# EasyEDA Pro project split-keyboard.epro, board PCB13
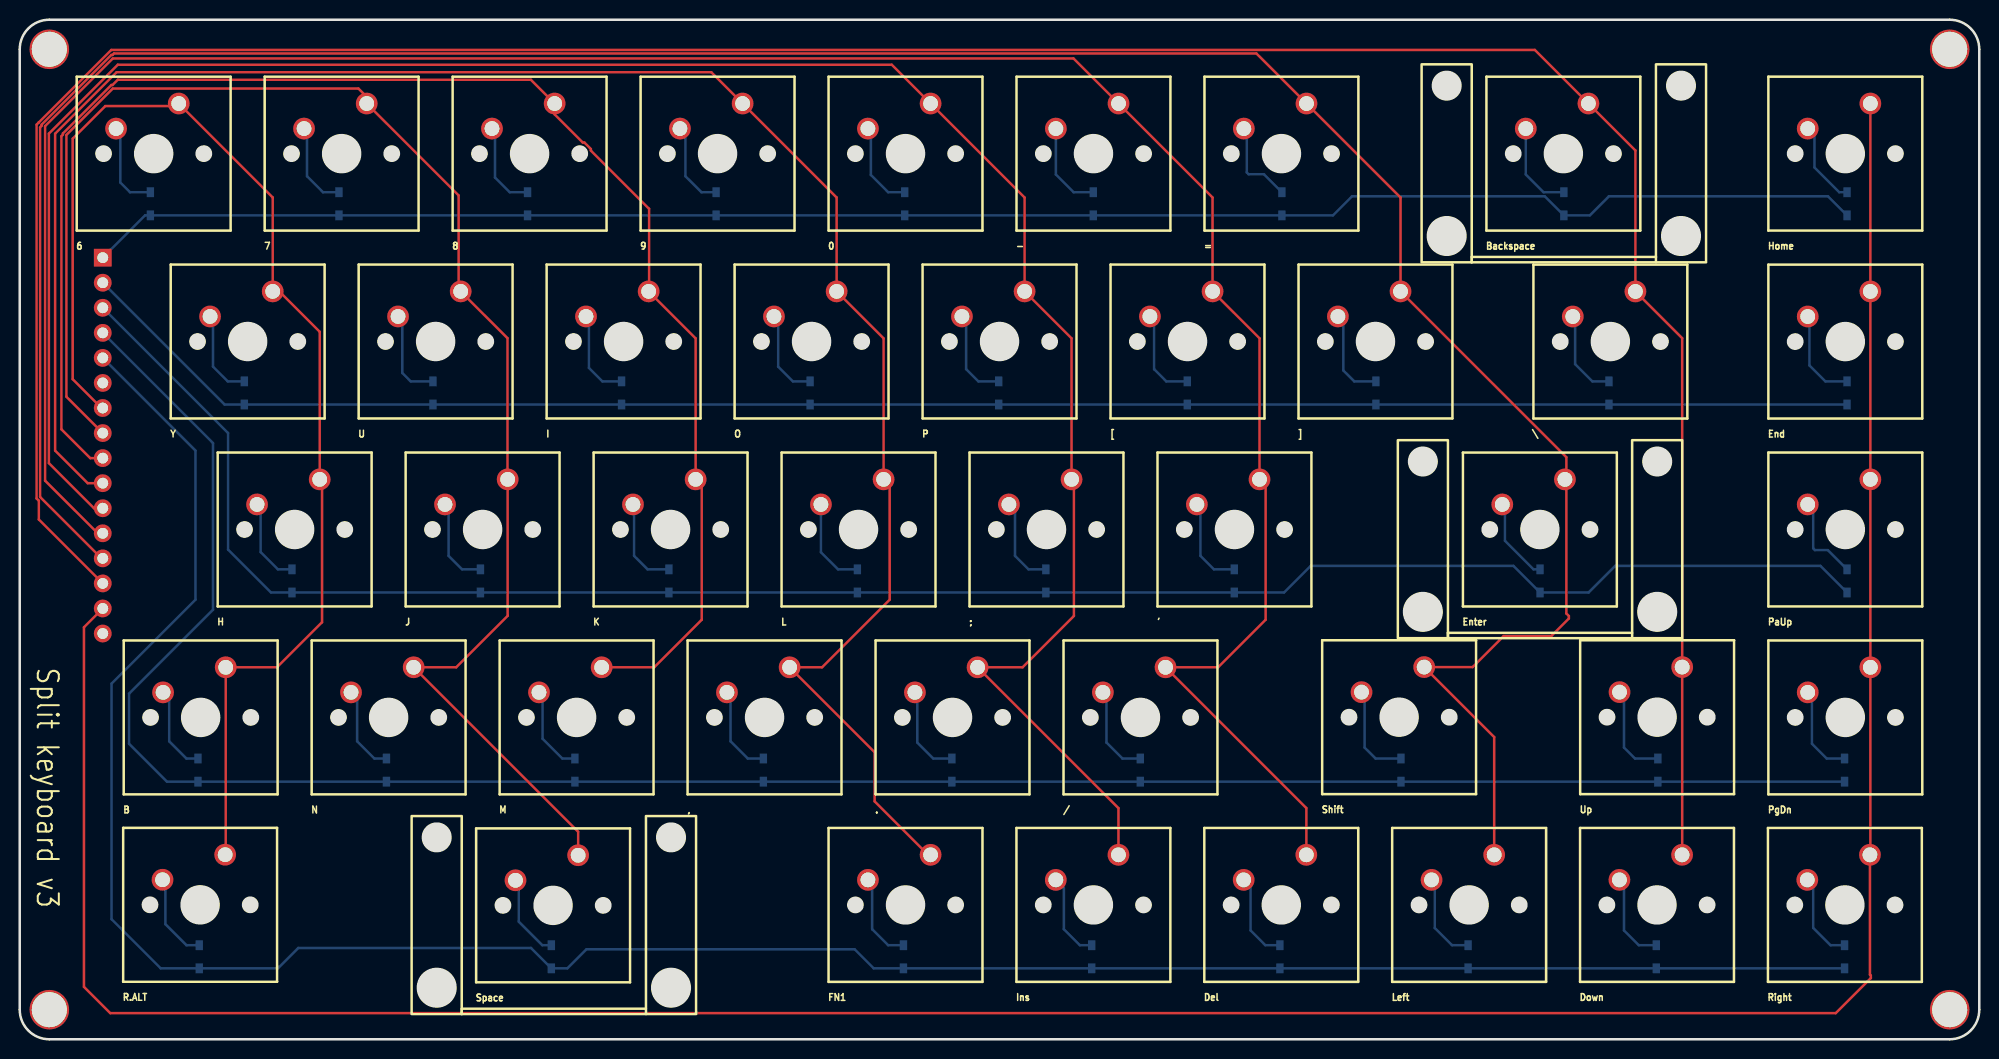
[diagram p7: board, top side]
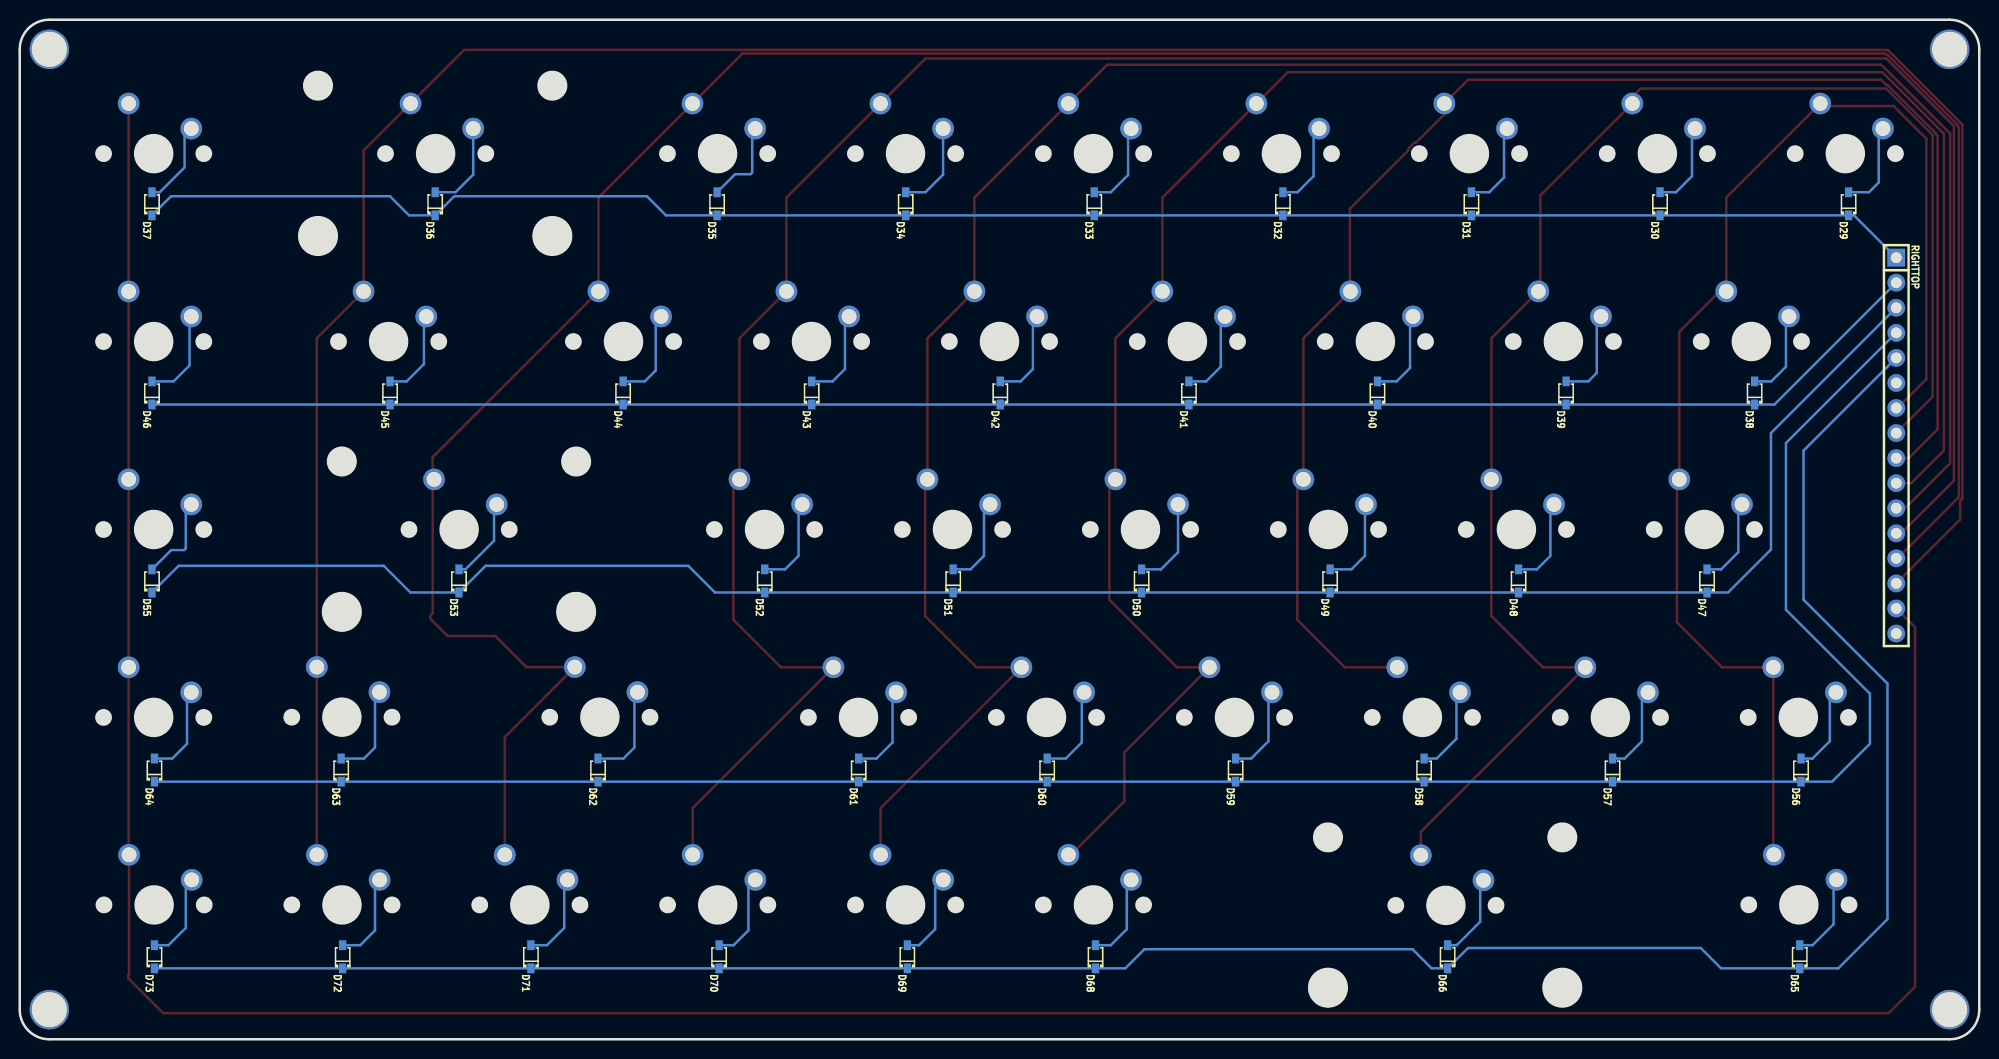
[diagram p8: board, bottom side, seen from below]

Outline 198.6 x 103.35 mm; copper layers: Top Layer, Bottom Layer. Coordinates in mm from the lower left corner of the outline.
Outline path: 0,100.35 0,3 arc(0.88,0.88) 3,0 195.6,0 arc(197.72,0.88) 198.6,3 198.6,100.35 arc(197.72,102.47) 195.6,103.35 3,103.35 arc(0.88,102.47) 0,100.35
Stack: Top Layer 0.035mm / Dielectric1 1.51mm FR4 er 4.5 / Bottom Layer 0.035mm

## Design rules (mm)
template: JLCPCB Capability(Two Layers Board)
spacing copperThickness1oz (default): track to track 0.102, other pairs 0.152 to 0.3
spacing copperThickness2oz: track to track 0.203, other pairs 0.152 to 0.3
track width copperThickness1oz (default): min 0.127, default 0.254, max 2.54
track width copperThickness2oz: min 0.203, default 0.254, max 2.54
differential pair differentialPair (default): width min 0.127, default 0.254, max 2.54; gap min 0.152, default 0.152
via viaSize (default): diameter min 0.5, default 0.61, max 10; hole min 0.3, default 0.305, max 6.3

## Placement (name value [footprint] x y rotation side)
0  MX1A-11NW  [cherry]  89.77 89.77 0 top
6  MX1A-11NW  [cherry]  13.57 89.77 0 top
7  MX1A-11NW  [cherry]  32.62 89.77 0 top
8  MX1A-11NW  [cherry]  51.67 89.77 0 top
9  MX1A-11NW  [cherry]  70.72 89.77 0 top
'  MX1A-11NW  [cherry]  123.11 51.67 0 top
,  MX1A-11NW  [cherry]  75.49 32.63 0 top
-  MX1A-11NW  [cherry]  108.82 89.77 0 top
.  MX1A-11NW  [cherry]  94.54 32.63 0 top
/  MX1A-11NW  [cherry]  113.59 32.63 0 top
;  MX1A-11NW  [cherry]  104.06 51.67 0 top
=  MX1A-11NW  [cherry]  127.87 89.77 0 top
[  MX1A-11NW  [cherry]  118.35 70.73 0 top
\  MX1A-11NW  [cherry]  161.21 70.72 0 top
]  MX1A-11NW  [cherry]  137.41 70.73 0 top
B  MX1A-11NW  [cherry]  18.34 32.63 0 top
Backspace  MX1A-11NW  [cherry]  156.45 89.77 0 top
BACKSPACE  -  [Cherry 2U Stabilizer Cutout]  54.07 13.61 0 top
D29  1N4148WS  [SOD-323_L1.8-W1.3-LS2.5-RD]  13.24 84.69 90 bottom
D30  1N4148WS  [SOD-323_L1.8-W1.3-LS2.5-RD]  32.35 84.69 90 bottom
D31  1N4148WS  [SOD-323_L1.8-W1.3-LS2.5-RD]  51.47 84.69 90 bottom
D32  1N4148WS  [SOD-323_L1.8-W1.3-LS2.5-RD]  70.58 84.69 90 bottom
D33  1N4148WS  [SOD-323_L1.8-W1.3-LS2.5-RD]  89.69 84.69 90 bottom
D34  1N4148WS  [SOD-323_L1.8-W1.3-LS2.5-RD]  108.81 84.69 90 bottom
D35  1N4148WS  [SOD-323_L1.8-W1.3-LS2.5-RD]  127.92 84.69 90 bottom
D36  1N4148WS  [SOD-323_L1.8-W1.3-LS2.5-RD]  156.5 84.69 90 bottom
D37  1N4148WS  [SOD-323_L1.8-W1.3-LS2.5-RD]  185.2 84.69 90 bottom
D38  1N4148WS  [SOD-323_L1.8-W1.3-LS2.5-RD]  22.77 65.51 90 bottom
D39  1N4148WS  [SOD-323_L1.8-W1.3-LS2.5-RD]  41.88 65.51 90 bottom
D40  1N4148WS  [SOD-323_L1.8-W1.3-LS2.5-RD]  60.99 65.51 90 bottom
D41  1N4148WS  [SOD-323_L1.8-W1.3-LS2.5-RD]  80.11 65.51 90 bottom
D42  1N4148WS  [SOD-323_L1.8-W1.3-LS2.5-RD]  99.22 65.51 90 bottom
D43  1N4148WS  [SOD-323_L1.8-W1.3-LS2.5-RD]  118.33 65.51 90 bottom
D44  1N4148WS  [SOD-323_L1.8-W1.3-LS2.5-RD]  137.45 65.51 90 bottom
D45  1N4148WS  [SOD-323_L1.8-W1.3-LS2.5-RD]  161.07 65.51 90 bottom
D46  1N4148WS  [SOD-323_L1.8-W1.3-LS2.5-RD]  185.2 65.51 90 bottom
D47  1N4148WS  [SOD-323_L1.8-W1.3-LS2.5-RD]  27.59 46.46 90 bottom
D48  1N4148WS  [SOD-323_L1.8-W1.3-LS2.5-RD]  46.69 46.46 90 bottom
D49  1N4148WS  [SOD-323_L1.8-W1.3-LS2.5-RD]  65.79 46.46 90 bottom
D50  1N4148WS  [SOD-323_L1.8-W1.3-LS2.5-RD]  84.89 46.46 90 bottom
D51  1N4148WS  [SOD-323_L1.8-W1.3-LS2.5-RD]  103.99 46.46 90 bottom
D52  1N4148WS  [SOD-323_L1.8-W1.3-LS2.5-RD]  123.09 46.46 90 bottom
D53  1N4148WS  [SOD-323_L1.8-W1.3-LS2.5-RD]  154.08 46.46 90 bottom
D55  1N4148WS  [SOD-323_L1.8-W1.3-LS2.5-RD]  185.2 46.46 90 bottom
D56  1N4148WS  [SOD-323_L1.8-W1.3-LS2.5-RD]  18.07 27.29 90 bottom
D57  1N4148WS  [SOD-323_L1.8-W1.3-LS2.5-RD]  37.17 27.29 90 bottom
D58  1N4148WS  [SOD-323_L1.8-W1.3-LS2.5-RD]  56.27 27.29 90 bottom
D59  1N4148WS  [SOD-323_L1.8-W1.3-LS2.5-RD]  75.37 27.29 90 bottom
D60  1N4148WS  [SOD-323_L1.8-W1.3-LS2.5-RD]  94.47 27.29 90 bottom
D61  1N4148WS  [SOD-323_L1.8-W1.3-LS2.5-RD]  113.57 27.29 90 bottom
D62  1N4148WS  [SOD-323_L1.8-W1.3-LS2.5-RD]  139.99 27.29 90 bottom
D63  1N4148WS  [SOD-323_L1.8-W1.3-LS2.5-RD]  166.02 27.29 90 bottom
D64  1N4148WS  [SOD-323_L1.8-W1.3-LS2.5-RD]  184.94 27.29 90 bottom
D65  1N4148WS  [SOD-323_L1.8-W1.3-LS2.5-RD]  18.19 8.36 90 bottom
D66  1N4148WS  [SOD-323_L1.8-W1.3-LS2.5-RD]  53.88 8.36 90 bottom
D68  1N4148WS  [SOD-323_L1.8-W1.3-LS2.5-RD]  89.57 8.36 90 bottom
D69  1N4148WS  [SOD-323_L1.8-W1.3-LS2.5-RD]  108.64 8.36 90 bottom
D70  1N4148WS  [SOD-323_L1.8-W1.3-LS2.5-RD]  127.72 8.36 90 bottom
D71  1N4148WS  [SOD-323_L1.8-W1.3-LS2.5-RD]  146.79 8.36 90 bottom
D72  1N4148WS  [SOD-323_L1.8-W1.3-LS2.5-RD]  165.87 8.36 90 bottom
D73  1N4148WS  [SOD-323_L1.8-W1.3-LS2.5-RD]  184.94 8.36 90 bottom
Del  MX1A-11NW  [cherry]  127.86 13.62 0 top
Down  MX1A-11NW  [cherry]  165.94 13.62 0 top
End  MX1A-11NW  [cherry]  185.02 70.72 0 top
Enter  MX1A-11NW  [cherry]  154.07 51.67 0 top
ENTER  -  [Cherry 2U Stabilizer Cutout]  154.02 51.71 0 top
FN1  MX1A-11NW  [cherry]  89.78 13.62 0 top
H  MX1A-11NW  [cherry]  27.86 51.67 0 top
Home  MX1A-11NW  [cherry]  185.02 89.77 0 top
I  MX1A-11NW  [cherry]  61.2 70.73 0 top
Ins  MX1A-11NW  [cherry]  108.82 13.62 0 top
J  MX1A-11NW  [cherry]  46.91 51.67 0 top
K  MX1A-11NW  [cherry]  65.96 51.67 0 top
L  MX1A-11NW  [cherry]  85.01 51.67 0 top
Left  MX1A-11NW  [cherry]  146.9 13.62 0 top
M  MX1A-11NW  [cherry]  56.44 32.63 0 top
N  MX1A-11NW  [cherry]  37.39 32.63 0 top
NOREF  -  [Pad_e411]  195.6 100.35 0 top
NOREF#2  -  [Pad_e412]  195.6 3 0 top
NOREF#3  -  [Pad_e413]  3 3 0 top
NOREF#4  -  [Pad_e407]  3 100.35 0 top
O  MX1A-11NW  [cherry]  80.25 70.73 0 top
P  MX1A-11NW  [cherry]  99.3 70.73 0 top
PaUp  MX1A-11NW  [cherry]  185.02 51.67 0 top
PgDn  MX1A-11NW  [cherry]  185.02 32.62 0 top
R.ALT  MX1A-11NW  [cherry]  18.28 13.63 0 top
Right  MX1A-11NW  [cherry]  184.98 13.62 0 top
RIGHTTOP  DS1021-1x16SF11-B  [HDR-TH_16P-P2.54-V-M]  8.41 60.18 270 bottom
Shift  MX1A-11NW  [cherry]  139.8 32.65 0 top
Space  MX1A-11NW  [cherry]  54.06 13.57 0 top
SPACEBAR  -  [Cherry 2U Stabilizer Cutout]  156.43 89.81 0 top
U  MX1A-11NW  [cherry]  42.15 70.73 0 top
Up  MX1A-11NW  [cherry]  165.95 32.65 0 top
Y  MX1A-11NW  [cherry]  23.1 70.73 0 top

## Footprints (pads in the part's own frame, mm; a bottom-side part is the same pattern mirrored in y, then rotated)
cherry
  round 2.2 hole 1.5: 1(-3.81,2.54) 2(2.54,5.08)
HDR-TH_16P-P2.54-V-M
  rect 1.8x1.8 hole 1.1: 1(-19.05,0)
  round 1.8 hole 1.1: 2(-16.51,0) 3(-13.97,0) 4(-11.43,0) 5(-8.89,0) 6(-6.35,0) 7(-3.81,0) 8(-1.27,0) 9(1.27,0) 10(3.81,0) 11(6.35,0) 12(8.89,0) 13(11.43,0) 14(13.97,0) 15(16.51,0) 16(19.05,0)
Pad_e407
  round 4 hole 3.55: 1(0,0)
Pad_e411
  round 4 hole 3.55: 2(0,0)
Pad_e412
  round 4 hole 3.55: 3(0,0)
Pad_e413
  round 4 hole 3.55: 4(0,0)
SOD-323_L1.8-W1.3-LS2.5-RD
  rect 1x0.75 smd: 1(-1.173,0) 2(1.173,0)

## Nets
As in the schematic.

Pads without a net: NOREF 2; NOREF#2 3; NOREF#3 4; NOREF#4 1; RIGHTTOP 6 16

## Routing (per net, layer and track width the routed paths; a pad name or vN(x,y) marks a point on that pad's centre or on a via; arc(x,y) is an arc through that point)
COL0: length 130.5
  Top Layer w0.254: R.ALT.2 20.88,18.76 20.88,37.71 26.07,37.71 30.64,42.27 30.64,56.52 H.2 30.4,71.72 26.31,75.81 Y.2 25.64,85.33 6.2 15.86,94.6 8.67,94.6 5.37,91.29 5.37,66.91 8.29,63.99 RIGHTTOP.7
COL1: length 160.6
  Top Layer w0.254: Space.2 56.6,21.04 N.2 44.23,37.71 49.45,42.92 J.2 49.44,56.77 49.44,71.07 U.2 44.48,76.02 44.48,85.54 7.2 35.16,95.53 34.32,96.37 9.43,96.37 4.73,91.67 4.73,65.13 RIGHTTOP.8
COL2: length 159.3
  Top Layer w0.254: M.2 64.3,37.71 69.12,42.53 69.12,56.14 K.2 68.5,71.05 I.2 63.79,75.85 63.79,84.18 57.88,90.08 57.88,90.24 57.22,90.9 57.06,90.9 54.21,93.75 8.2 51.81,97.26 9.94,97.26 9.4,96.73 9.28,96.73 4.38,91.82 4.38,91.7 4.22,91.55 4.22,61.83 7.14,58.91 RIGHTTOP.9
COL3: length 206.4
  Top Layer w0.254: FN1.2 92.06,18.7 86.65,24.11 86.65,29.09 ,.2 81.32,37.71 88.17,44.56 88.17,56.14 L.2 87.55,71.05 O.2 82.79,85.33 9.2 70.09,98.02 9.81,98.02 3.59,91.8 3.59,59.67 6.89,56.37 RIGHTTOP.10
COL4: length 229.4
  Top Layer w0.254: Ins.2 111.36,23.43 ..2 101.64,37.71 106.84,42.91 106.84,56.52 ;.2 106.6,71.05 P.2 101.84,85.32 0.2 88.38,98.79 9.94,98.79 2.95,91.8 2.95,58.4 7.52,53.83 RIGHTTOP.11
COL5: length 253.1
  Top Layer w0.254: Del.2 130.4,23.44 /.2 121.45,37.71 126.27,42.53 126.27,56.14 '.2 125.65,71.05 [.2 120.89,85.32 -.2 106.8,99.42 9.43,99.42 2.57,92.56 2.57,56.62 7.91,51.29 RIGHTTOP.12
COL6: length 281.9
  Top Layer w0.254: Left.2 149.44,30.63 Shift.2 147.25,37.73 150.4,40.88 155.23,40.88 157,42.65 157,42.91 156.75,43.16 156.75,59.01 ].2 139.95,85.32 =.2 125.34,99.93 9.56,99.93 9.4,99.78 9.28,99.78 2.22,92.71 2.22,92.59 2.06,92.44 2.06,54.97 8.29,48.75 RIGHTTOP.13
COL7: length 292
  Top Layer w0.254: RIGHTTOP.14 1.94,52.69 1.94,54.6 1.71,54.82 1.71,92.71 1.94,92.94 1.94,92.94 9.28,100.29 153.56,100.29 Backspace.2 163.75,90.09 \.2 168.49,71.06 Up.2 168.49,18.71 Down.2
COL8: length 311.5
  Top Layer w0.254: RIGHTTOP.15 6.51,41.76 6.51,5.31 9.18,2.65 184.06,2.65 187.61,6.2 187.61,6.46 187.52,6.55 Right.2 187.56,18.74 PgDn.2 PaUp.2 End.2 Home.2
ROW0: length 181.8
  Bottom Layer w0.254: RIGHTTOP.1 12.7,83.52 D29.1 D30.1 D31.1 D32.1 D33.1 D34.1 D35.1 133.1,83.52 135.03,85.45 154.56,85.45 D36.1 159.13,83.52 161.07,85.45 183.26,85.45 D37.1
ROW1: length 181.9
  Bottom Layer w0.254: RIGHTTOP.2 20.76,64.34 D38.1 D39.1 D40.1 D41.1 D42.1 D43.1 D44.1 D45.1 D46.1
ROW2: length 200.1
  Bottom Layer w0.254: D55.1 182.5,47.99 161.7,47.99 159.01,45.29 D53.1 151.39,47.99 130.84,47.99 128.15,45.29 D52.1 D51.1 D50.1 D49.1 D48.1 D47.1 25.46,45.29 21.11,49.64 21.11,61.45 RIGHTTOP.3
ROW3: length 225.3
  Bottom Layer w0.254: RIGHTTOP.4 19.59,60.43 19.59,43.54 11.08,35.03 11.08,29.95 14.92,26.11 D56.1 D57.1 D58.1 D59.1 D60.1 D61.1 D62.1 D63.1 D64.1
ROW4: length 245.3
  Bottom Layer w0.254: D73.1 D72.1 D71.1 D70.1 D69.1 D68.1 86.55,7.19 84.61,9.12 57.44,9.12 55.5,7.19 D66.1 51.82,9.25 28.23,9.25 26.16,7.19 D65.1 14.29,7.19 9.3,12.17 9.3,36.05 17.81,44.56 17.81,59.67 RIGHTTOP.5
$1N131: length 9.1
  Bottom Layer w0.254: D29.2 11.18,85.86 10.19,86.85 10.19,91.89 9.76,92.31
$1N2292: length 8.9
  Bottom Layer w0.254: 28.81,92.31 29.11,92.01 29.11,87.48 30.74,85.86 D30.2
$1N2364: length 9
  Bottom Layer w0.254: D31.2 49.66,85.86 48.16,87.36 48.16,92.01 47.86,92.31
$1N2436: length 8.8
  Bottom Layer w0.254: D32.2 69.09,85.86 67.47,87.48 67.47,91.76 66.91,92.31
$1N2508: length 9
  Bottom Layer w0.254: 85.96,92.31 86.27,92.01 86.27,87.61 88.01,85.86 D33.2
$1N2580: length 9.2
  Bottom Layer w0.254: 105.01,92.31 105.01,87.66 106.81,85.86 D34.2
$1N2652: length 9
  Bottom Layer w0.254: 124.06,92.31 124.36,92.01 124.36,87.86 124.54,87.69 126.1,87.69 D35.2
$1N2724: length 9.3
  Bottom Layer w0.254: D36.2 154.43,85.86 152.64,87.66 Backspace.1
$1N2796: length 8.6
  Bottom Layer w0.254: Home.1 181.9,91.63 181.9,88.37 184.41,85.86 D37.2
$1N2868: length 9
  Bottom Layer w0.254: D38.2 21.08,66.69 19.59,68.18 19.59,72.97 Y.1
$1N2940: length 9.4
  Bottom Layer w0.254: D39.2 39.63,66.69 38.77,67.54 38.77,72.84 U.1
$1N3012: length 9.2
  Bottom Layer w0.254: D40.2 59.06,66.69 57.69,68.05 57.69,72.97 I.1
$1N3084: length 9.1
  Bottom Layer w0.254: O.1 76.87,72.85 76.87,68.18 78.36,66.69 D41.2
$1N3156: length 9.3
  Bottom Layer w0.254: P.1 95.92,72.85 95.92,67.93 97.16,66.69 D42.2
$1N3228: length 9.4
  Bottom Layer w0.254: D43.2 116.21,66.69 114.97,67.93 114.97,72.85 [.1
$1N3300: length 9.5
  Bottom Layer w0.254: ].1 134.14,72.72 134.14,67.8 135.26,66.69 D44.2
$1N3372: length 9.1
  Bottom Layer w0.254: \.1 157.64,73.03 157.64,68.43 159.39,66.69 D45.2
$1N3444: length 9.5
  Bottom Layer w0.254: D46.2 183.01,66.69 181.39,68.31 181.39,73.09 End.1
$1N3516: length 8.9
  Bottom Layer w0.254: D47.2 26.16,47.64 24.42,49.38 24.42,53.85 H.1
$1N3588: length 9.2
  Bottom Layer w0.254: J.1 43.47,53.85 43.47,49 44.83,47.64 D48.2
$1N3660: length 9.4
  Bottom Layer w0.254: K.1 62.26,54.11 62.26,49 63.63,47.64 D49.2
$1N3732: length 9.3
  Bottom Layer w0.254: D50.2 82.93,47.64 81.2,49.37 L.1
$1N3804: length 9.2
  Bottom Layer w0.254: D51.2 102.24,47.64 100.87,49 100.87,53.6 ;.1
$1N3876: length 9.4
  Bottom Layer w0.254: D52.2 121.03,47.64 119.67,49 119.67,53.85 '.1
$1N3948: length 8.6
  Bottom Layer w0.254: D53.2 153.42,47.64 150.53,50.53 150.53,53.94 Enter.1
$1N4092: length 9
  Bottom Layer w0.254: D55.2 183.25,49.59 181.95,49.59 181.77,49.77 181.77,53.66 PaUp.1
$1N4164: length 8.9
  Bottom Layer w0.254: B.1 15.14,34.55 15.14,30.21 16.89,28.46 D56.2
$1N4236: length 8.9
  Bottom Layer w0.254: D57.2 35.94,28.46 34.19,30.21 34.19,34.55 N.1
$1N4308: length 9
  Bottom Layer w0.254: M.1 52.99,34.8 52.99,30.46 54.99,28.46 D58.2
$1N4380: length 9.2
  Bottom Layer w0.254: D59.2 73.79,28.46 72.04,30.21 72.04,34.8 ,.1
$1N4452: length 9.4
  Bottom Layer w0.254: ..1 90.96,34.93 90.96,30.08 92.59,28.46 D60.2
$1N4524: length 9.3
  Bottom Layer w0.254: /.1 110.14,34.8 110.14,30.08 111.76,28.46 D61.2
$1N4596: length 9.9
  Bottom Layer w0.254: Shift.1 136.3,34.88 136.3,29.57 137.42,28.46 D62.2
$1N4668: length 9.7
  Bottom Layer w0.254: Up.1 162.59,34.74 162.59,29.57 163.71,28.46 D63.2
$1N4740: length 9.3
  Bottom Layer w0.254: D64.2 183.14,28.46 181.64,29.95 181.64,34.74 PgDn.1
$1N4812: length 8.9
  Bottom Layer w0.254: R.ALT.1 14.76,15.88 14.76,11.66 16.89,9.54 D65.2
$1N4884: length 8.6
  Bottom Layer w0.254: D66.2 52.96,9.54 50.58,11.92 50.58,15.78 Space.1
$1N5028: length 9
  Bottom Layer w0.254: D68.2 88.01,9.54 86.39,11.16 86.39,15.73 FN1.1
$1N5100: length 8.8
  Bottom Layer w0.254: D69.2 107.44,9.54 105.82,11.16 105.82,15.34 Ins.1
$1N5172: length 9
  Bottom Layer w0.254: D70.2 126.24,9.54 124.75,11.03 124.75,15.46 Del.1
$1N5244: length 9.1
  Bottom Layer w0.254: D71.2 145.16,9.54 143.42,11.28 143.42,15.83 Left.1
$1N5316: length 9.2
  Bottom Layer w0.254: Down.1 162.59,15.7 162.59,11.03 164.09,9.54 D72.2
$1N5388: length 9
  Bottom Layer w0.254: Right.1 181.77,15.56 181.77,11.28 183.52,9.54 D73.2

## Text on the board
Top Silkscreen Layer: Split keyboard v3
